# EAGLE design Handdisplay2 (EAGLE 6.6.0)
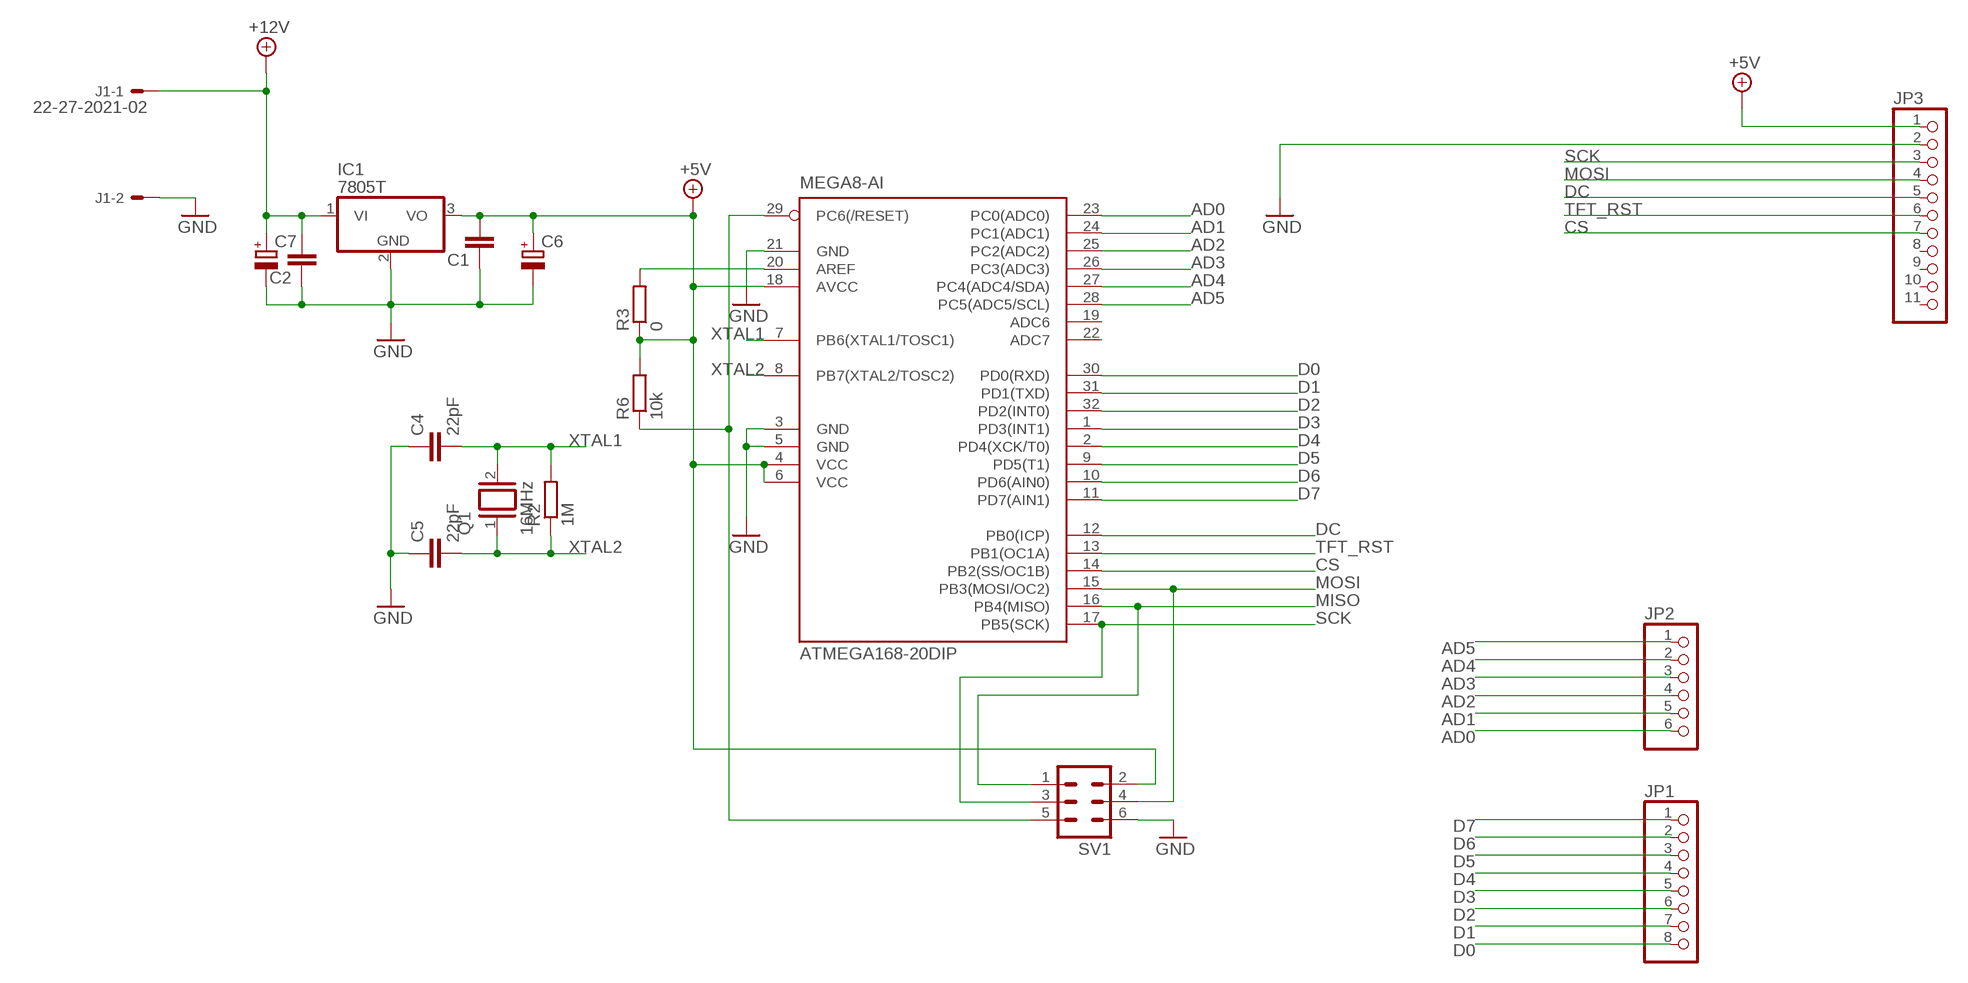
[diagram p0: schematic, sheet 1]

## Parts
ATMEGA168-20DIP  MEGA8-AI  [TQFP32-08]
C1  C-EUC0805  [C0805]
C2  C-EUC0805  [C0805]
C4  22pF  C-EUC0805  [C0805]
C5  22pF  C-EUC0805  [C0805]
C6  CPOL-EUUD-5X5,8  [UD-5X5,8_NICHICON]
C7  CPOL-EUUD-5X5,8  [UD-5X5,8_NICHICON]
IC1  7805T  [TO220H]
J1  22-27-2021-02  [6410-02]
JP1  PINHD-1X8  [1X08]
JP2  PINHD-1X6  [1X06]
JP3  PINHD-1X11  [1X11]
Q1  16MHz  XTAL/S  [QS]
R2  1M  R-EU_R0805  [R0805]
R3  0  R-EU_R0805  [R0805]
R6  10k  R-EU_R0805  [R0805]
SV1  ML6  [ML6]

## Nets
+5V: ATMEGA168-20DIP.4(VCC) ATMEGA168-20DIP.6(VCC) ATMEGA168-20DIP.18(AVCC) C1.2 C6.+ IC1.3(VO) JP3.1 R3.1 R6.2 SV1.2
+12V: C2.2 C7.+ IC1.1(VI) J1.1
AD0: ATMEGA168-20DIP.23(PC0(ADC0)) JP2.6
AD1: ATMEGA168-20DIP.24(PC1(ADC1)) JP2.5
AD2: ATMEGA168-20DIP.25(PC2(ADC2)) JP2.4
AD3: ATMEGA168-20DIP.26(PC3(ADC3)) JP2.3
AD4: ATMEGA168-20DIP.27(PC4(ADC4/SDA)) JP2.2
AD5: ATMEGA168-20DIP.28(PC5(ADC5/SCL)) JP2.1
CS: ATMEGA168-20DIP.14(PB2(SS/OC1B)) JP3.7
D0: ATMEGA168-20DIP.30(PD0(RXD)) JP1.8
D1: ATMEGA168-20DIP.31(PD1(TXD)) JP1.7
D2: ATMEGA168-20DIP.32(PD2(INT0)) JP1.6
D3: ATMEGA168-20DIP.1(PD3(INT1)) JP1.5
D4: ATMEGA168-20DIP.2(PD4(XCK/T0)) JP1.4
D5: ATMEGA168-20DIP.9(PD5(T1)) JP1.3
D6: ATMEGA168-20DIP.10(PD6(AIN0)) JP1.2
D7: ATMEGA168-20DIP.11(PD7(AIN1)) JP1.1
DC: ATMEGA168-20DIP.12(PB0(ICP)) JP3.5
GND: ATMEGA168-20DIP.3(GND) ATMEGA168-20DIP.5(GND) ATMEGA168-20DIP.21(GND) C1.1 C2.1 C4.1 C5.1 C6.- C7.- IC1.2(GND) J1.2 JP3.2 SV1.6
MISO: ATMEGA168-20DIP.16(PB4(MISO)) SV1.1
MOSI: ATMEGA168-20DIP.15(PB3(MOSI/OC2)) JP3.4 SV1.4
N$2: ATMEGA168-20DIP.20(AREF) R3.2
N$15: ATMEGA168-20DIP.29(PC6(/RESET)) R6.1 SV1.5
SCK: ATMEGA168-20DIP.17(PB5(SCK)) JP3.3 SV1.3
TFT_RST: ATMEGA168-20DIP.13(PB1(OC1A)) JP3.6
XTAL1: ATMEGA168-20DIP.7(PB6(XTAL1/TOSC1)) C4.2 Q1.2 R2.2
XTAL2: ATMEGA168-20DIP.8(PB7(XTAL2/TOSC2)) C5.2 Q1.1 R2.1
Unconnected: ATMEGA168-20DIP.19(ADC6) ATMEGA168-20DIP.22(ADC7) JP3.8 JP3.9 JP3.10 JP3.11

## Library data of the parts
ATMEGA168-20DIP = atmel:MEGA8: MICROCONTROLLER 8 Kbytes FLASH, 1 kbytes SRAM, 512 bytes EEPROM, USART, 6-channel 10 bit ADC, 2-channel 8 bit ADC Pin compatible with Atmega48, ATMega88, ATMega168 Source: avr.lbr; MPN: ATMEGA8-16AU; OC_FARNELL: 9171371; OC_NEWARK: 73M8863
C1 C2 C4 C5 = rcl:C-EU: CAPACITOR, European symbol
C6 C7 = rcl:CPOL-EU: POLARIZED CAPACITOR, European symbol
IC1 = linear:78*: Positive VOLTAGE REGULATOR Source: http://cache.national.com/ds/LM/LM78L05.pdf http://www.fairchildsemi.com/ds/LM/LM7805.pdf
J1 = con-molex:22-?-02: CONNECTOR wire to board 2.54 mm (.1 inch) pitch header; OC_FARNELL: unknown; OC_NEWARK: unknown
JP1 = pinhead:PINHD-1X8: PIN HEADER
JP2 = pinhead:PINHD-1X6: PIN HEADER
JP3 = pinhead:PINHD-1X11: PIN HEADER
Q1 = special:XTAL/S: CRYSTAL
R2 R3 R6 = rcl:R-EU_: RESISTOR, European symbol
SV1 = con-ml:ML6: HARTING; OC_FARNELL: unknown; OC_NEWARK: unknown

## Net classes
0 default: clearance 0.254 mm

## Board
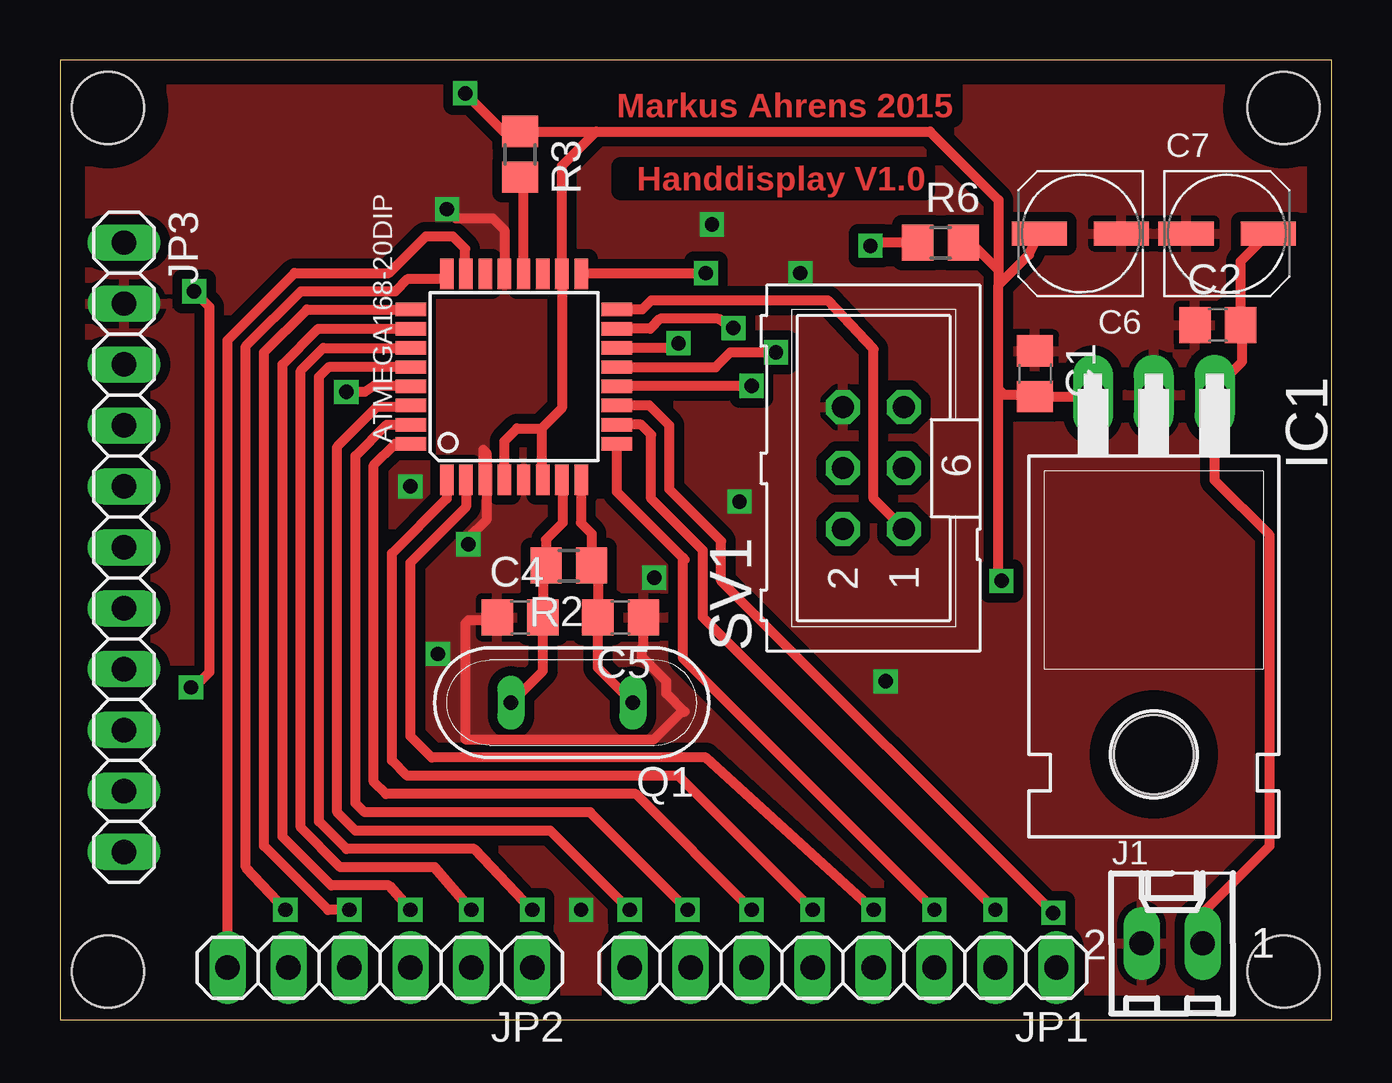
[diagram p1: board, top side]
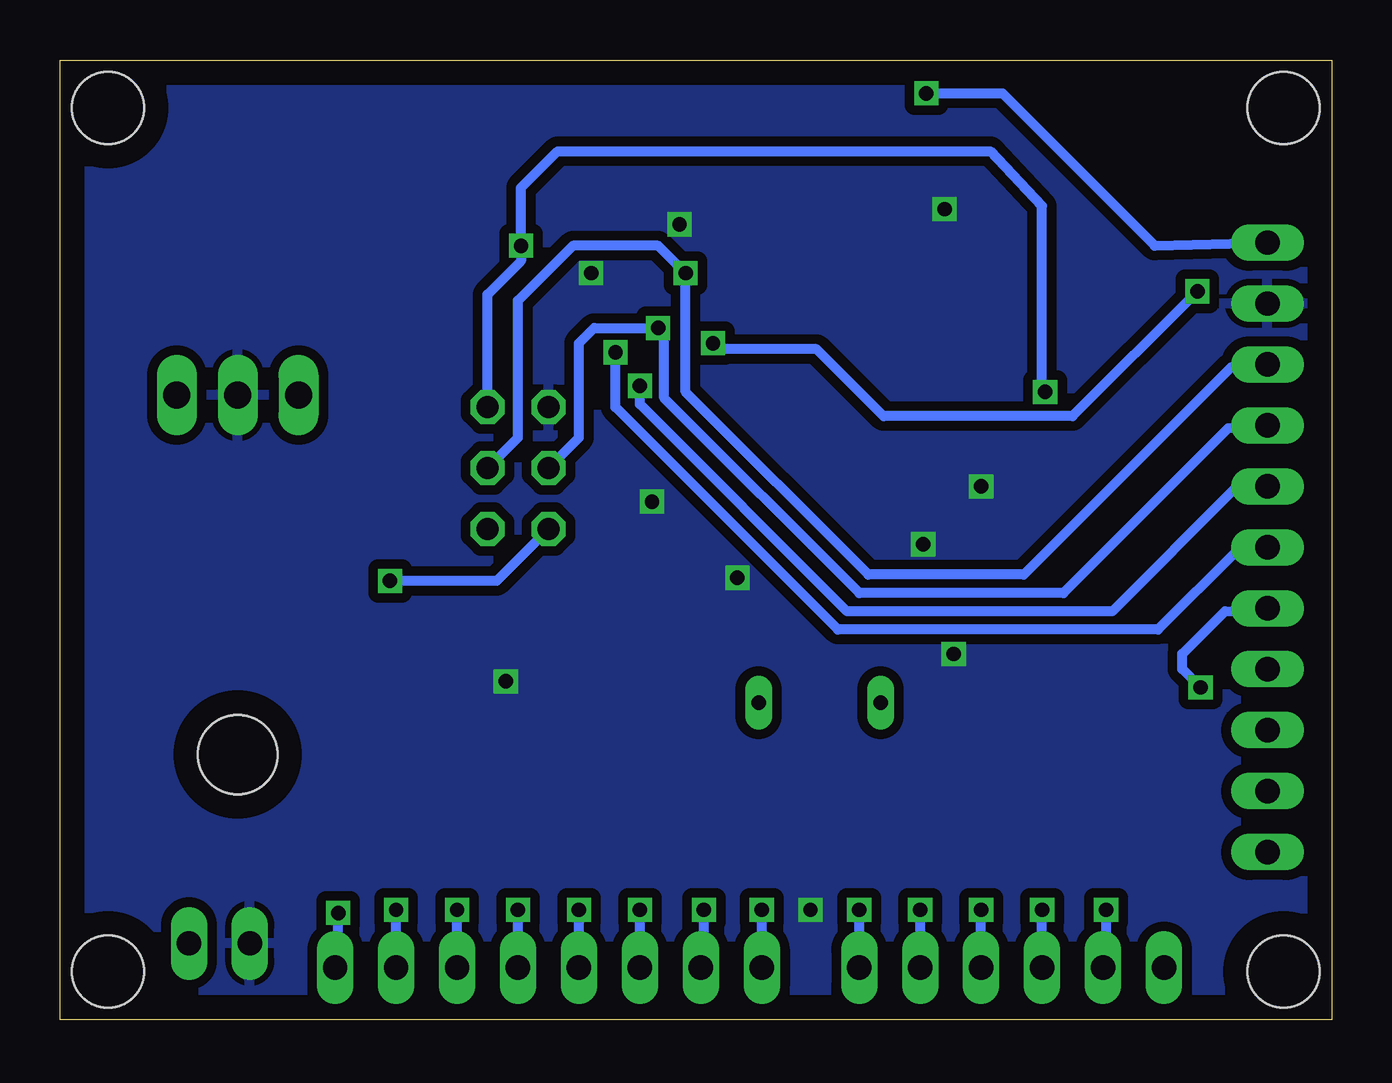
[diagram p2: board, bottom side, seen from below]

Size 53 x 40 mm. Coordinates in mm from the lower left corner, seen from the top.
Outline: 0,0 53,0 53,40 0,40 0,0
Copper layers (1*16): Top 0.035mm / dielectric 1.5mm / Bottom 0.035mm
Design rules "default *": minimum track width 10mil, minimum drill 24mil, track to track 16mil, track to pad 8mil, pad to pad 8mil, via to via 8mil, smd to smd 8mil, copper to edge 40mil, drill to drill 8mil, minimum pad ring 10mil, minimum via ring 8mil, stop-mask expansion 4mil, vias tented up to drill 0mil, thermal gap 10mil
Holes 3 mm at 2,38 51,38 51,2 2,2

### Footprints (pad centres in the part's own frame; a part is rotated, then mirrored left to right if it is on the bottom)
TQFP32-08 = smd 1.27 x 0.559: 1 -4.293,2.8; 2 -4.293,2; 3 -4.293,1.2; 4 -4.293,0.4; 5 -4.293,-0.4; 6 -4.293,-1.2; 7 -4.293,-2; 8 -4.293,-2.8; 17 4.293,-2.8; 18 4.293,-2; 19 4.293,-1.2; 20 4.293,-0.4; 21 4.293,0.4; 22 4.293,1.2; 23 4.293,2; 24 4.293,2.8 | smd 0.559 x 1.27: 9 -2.8,-4.293; 10 -2,-4.293; 11 -1.2,-4.293; 12 -0.4,-4.293; 13 0.4,-4.293; 14 1.2,-4.293; 15 2,-4.293; 16 2.8,-4.293; 25 2.8,4.293; 26 2,4.293; 27 1.2,4.293; 28 0.4,4.293; 29 -0.4,4.293; 30 -1.2,4.293; 31 -2,4.293; 32 -2.8,4.293
C0805 = smd 1.3 x 1.5: 1 -0.95,0; 2 0.95,0
UD-5X5,8_NICHICON = smd 2.3 x 1: + 1.725,0; - -1.7,0
TO220H = drill 1.118 long: 1 -2.54,-10.16; 2 0,-10.16; 3 2.54,-10.16 | hole 3.302: 0,4.826
6410-02 = drill 1.016 long: 1 1.27,0; 2 -1.27,0
1X08 = drill 1.016 long: 1 -8.89,0; 2 -6.35,0; 3 -3.81,0; 4 -1.27,0; 5 1.27,0; 6 3.81,0; 7 6.35,0; 8 8.89,0
1X06 = drill 1.016 long: 1 -6.35,0; 2 -3.81,0; 3 -1.27,0; 4 1.27,0; 5 3.81,0; 6 6.35,0
1X11 = drill 1.016 long: 1 -12.7,0; 2 -10.16,0; 3 -7.62,0; 4 -5.08,0; 5 -2.54,0; 6 0,0; 7 2.54,0; 8 5.08,0; 9 7.62,0; 10 10.16,0; 11 12.7,0
QS = drill 0.61 long: 1 -2.54,0; 2 2.54,0
R0805 = smd 1.3 x 1.5: 1 -0.95,0; 2 0.95,0
ML6 = drill 0.914 octagon: 1 -2.54,-1.27; 2 -2.54,1.27; 3 0,-1.27; 4 0,1.27; 5 2.54,-1.27; 6 2.54,1.27

### Placement (x,y rotation side)
ATMEGA168-20DIP  18.92,26.8 90 top
C1  40.64,26.92 270 top
C2  48.26,28.96 0 top
C4  19.18,16.76 0 top
C5  23.37,16.76 180 top
C6  42.55,32.77 180 top
C7  48.64,32.77 0 top
IC1  45.59,15.88 180 top
J1  46.35,3.17 0 top
JP1  32.64,2.16 180 top
JP2  13.34,2.16 180 top
JP3  2.67,19.68 270 top
Q1  21.34,13.21 180 top
R2  21.21,18.92 180 top
R3  19.18,36.07 270 top
R6  36.7,32.38 0 top
SV1  33.91,22.99 90 top

### Tracks (layer width: path | path; a pad name or v marks a point on that pad's centre or on a via)
+5V  (via drill 0.6)
  Top 0.406: IC1.3 arc-90 42.99,25.97 C1.2 40.58,26.04 39.37,26.04 39.12,26.29 | 39.12,26.29 39.12,30.61 | 39.12,30.61 40.39,31.88 C6.+ | 22.35,37.02 R3.1 18.48,37.02 v16.89,38.61 | 22.35,37.02 36.26,37.02 39.12,34.16 39.12,31.24 | 39.12,31.24 39.12,30.61 | 22.35,37.02 20.92,35.59 ATMEGA168-20DIP.18 20.92,25.5 20.07,24.64 | R6.2 37.97,32.38 39.12,31.24 | v39.24,18.29 39.12,18.41 39.12,26.29 | 20.07,24.64 20.07,22.56 ATMEGA168-20DIP.6 | ATMEGA168-20DIP.4 18.52,24.11 19.05,24.64 20.07,24.64
  Bottom 0.406: SV1.2 34.8,18.29 v39.24,18.29 | v16.89,38.61 13.72,38.61 7.37,32.26 JP3.1
+12V
  Top 0.406: J1.1 47.62,4.45 50.42,7.24 50.42,20.19 48.13,22.48 IC1.1 48.13,26.29 49.28,27.43 49.28,28.89 C2.2 49.21,31.61 C7.+
AD0
  Top 0.406: JP2.6 6.99,28.32 9.78,31.11 13.72,31.11 15.24,32.64 16.38,32.64 16.89,32.13 16.89,31.12 ATMEGA168-20DIP.23
AD1  (via drill 0.6)
  Top 0.406: ATMEGA168-20DIP.24 15.89,30.86 14.48,30.86 13.97,30.35 10.03,30.35 7.75,28.07 7.75,6.35 v9.4,4.57
  Bottom 0.406: v9.4,4.57 9.4,2.29 JP2.5
AD2  (via drill 0.6)
  Top 0.406: v12.06,4.57 11.18,4.57 8.51,7.24 8.51,27.81 10.29,29.6 ATMEGA168-20DIP.25
  Bottom 0.406: JP2.4 v12.06,4.57
AD3  (via drill 0.6)
  Top 0.406: v14.61,4.57 13.72,5.59 11.3,5.59 9.27,7.62 9.27,27.3 10.76,28.8 ATMEGA168-20DIP.26
  Bottom 0.406: JP2.3 v14.61,4.57
AD4  (via drill 0.6)
  Top 0.406: v17.14,4.57 15.62,6.35 11.68,6.35 10.03,8 10.03,27.05 10.98,28 ATMEGA168-20DIP.27
  Bottom 0.406: JP2.2 v17.14,4.57
AD5  (via drill 0.6)
  Top 0.406: v19.68,4.57 17.27,7.11 11.94,7.11 10.79,8.26 10.79,26.8 11.2,27.2 ATMEGA168-20DIP.28
  Bottom 0.406: JP2.1 v19.68,4.57
CS  (via drill 0.6)
  Top 0.406: v25.78,28.19 arc90 25.85,28 ATMEGA168-20DIP.14 | v5.59,30.35 6.22,29.72 6.22,14.48 5.59,13.84 v5.46,13.84
  Bottom 0.406: v25.78,28.19 25.65,27.94 21.46,27.94 18.67,25.15 10.79,25.15 v5.59,30.35 | v5.46,13.84 6.22,14.61 6.22,15.24 4.45,17.02 JP3.7
D0  (via drill 0.6)
  Top 0.406: v23.75,4.57 20.45,7.87 12.32,7.87 11.56,8.64 11.56,23.88 13.21,25.53 14.56,25.53 ATMEGA168-20DIP.30
  Bottom 0.406: JP1.8 v23.75,4.57
D1  (via drill 0.6)
  Top 0.406: v26.16,4.57 22.1,8.64 12.7,8.64 12.32,9.02 12.32,23.5 13.62,24.8 ATMEGA168-20DIP.31
  Bottom 0.406: v26.16,4.57 26.16,2.29 JP1.7
D2  (via drill 0.6)
  Top 0.406: v28.83,4.57 24,9.4 13.59,9.4 13.08,9.91 13.08,23.11 13.96,24 ATMEGA168-20DIP.32
  Bottom 0.406: JP1.6 v28.83,4.57
D3  (via drill 0.6)
  Top 0.406: v31.37,4.57 25.78,10.16 14.48,10.16 13.84,10.79 13.84,19.43 16.12,21.71 ATMEGA168-20DIP.1
  Bottom 0.406: JP1.5 v31.37,4.57
D4  (via drill 0.6)
  Top 0.406: v33.91,4.57 26.92,10.92 15.49,10.92 14.61,11.81 14.61,19.05 16.92,21.37 ATMEGA168-20DIP.2
  Bottom 0.406: JP1.4 v33.91,4.57
D5  (via drill 0.6)
  Top 0.406: 26.04,19.18 25.97,19.24 | 25.97,19.24 23.22,22 ATMEGA168-20DIP.9 | v36.45,4.57 25.97,15.05 25.97,19.24
  Bottom 0.406: JP1.3 v36.45,4.57
D6  (via drill 0.6)
  Top 0.406: ATMEGA168-20DIP.10 24.23,24.8 24.64,24.38 24.64,21.72 26.8,19.56 26.8,16.76 v38.99,4.57
  Bottom 0.406: JP1.2 v38.99,4.57
D7  (via drill 0.6)
  Top 0.406: ATMEGA168-20DIP.11 24.57,25.6 25.4,24.77 25.4,22.1 27.56,19.94 27.56,18.29 v41.4,4.45
  Bottom 0.406: JP1.1 41.4,2.29 v41.4,4.45
DC  (via drill 0.6)
  Top 0.406: v28.83,26.42 28.81,26.4 ATMEGA168-20DIP.12
  Bottom 0.406: v28.83,26.42 28.83,25.65 20.19,17.02 9.14,17.02 4.06,22.1 JP3.5
GND  (via drill 0.6)
  Top 0.406: v16.13,33.78 16.51,33.4 18.03,33.4 18.52,32.91 ATMEGA168-20DIP.21 | ATMEGA168-20DIP.3 17.65,22.57 17.65,23.75 17.78,23.62 17.78,20.83 17.02,20.07 v17.02,19.81 | C4.1 18.1,16.64 17.02,16.64 16.89,16.51 16.89,11.68 24.77,11.68 25.91,12.83 26.04,12.83 25.27,13.59 25.27,14.1 24.26,15.11 24.26,15.49 24.32,15.55 C5.1
  other vias: 27.18,33.15 14.61,22.23 15.75,15.24 28.32,21.59 34.42,14.1 30.86,31.11 21.72,4.57 24.77,18.41
  pour Top: 0.13,-0.13 53.09,-0.13 53.09,40.51 0.13,40.51
  pour Bottom: 0.13,-0.13 53.09,-0.13 53.09,40.64 0.13,40.64
MISO
  Top 0.406: SV1.1 33.91,21.72 33.91,27.94 32,29.97 24.64,29.97 24.26,29.6 ATMEGA168-20DIP.16
MOSI  (via drill 0.6)
  Top 0.406: v28.07,28.83 27.43,29.21 25.02,29.21 24.61,28.8 ATMEGA168-20DIP.15
  Bottom 0.406: SV1.4 31.37,24.26 31.37,28.19 30.73,28.83 v28.07,28.83 27.81,28.83 27.81,25.91 19.68,17.78 11.18,17.78 4.32,24.64 JP3.4
N$2
  Top 0.406: ATMEGA168-20DIP.20 19.32,35.12 R3.2
N$15  (via drill 0.6)
  Top 0.406: ATMEGA168-20DIP.29 14.61,26.42 13.08,26.42 12.7,26.16 v11.94,26.16 | R6.1 33.91,32.38 v33.78,32.26
  Bottom 0.406: SV1.5 35.18,30.23 33.78,31.62 v33.78,32.26 33.78,34.67 32.26,36.2 14.22,36.2 12.06,33.91 12.06,26.16 v11.94,26.16
SCK  (via drill 0.6)
  Top 0.406: v26.92,31.11 26.7,31.09 ATMEGA168-20DIP.17
  Bottom 0.406: SV1.3 33.91,24.26 33.91,29.97 31.62,32.26 28.07,32.26 v26.92,31.11 26.92,26.16 19.3,18.54 12.83,18.54 4.19,27.18 JP3.3
TFT_RST  (via drill 0.6)
  Top 0.406: ATMEGA168-20DIP.13 27.32,27.2 27.94,27.81 v29.84,27.81
  Bottom 0.406: v29.84,27.81 29.84,25.53 20.57,16.26 7.24,16.26 3.94,19.56 JP3.6
XTAL1
  Top 0.406: ATMEGA168-20DIP.7 20.95,22.47 20.95,20.7 20.26,20 R2.2 20.13,18.79 C4.2 20.13,14.54 Q1.2
XTAL2
  Top 0.406: ATMEGA168-20DIP.8 21.72,20.7 22.16,20.26 R2.1 22.42,18.66 C5.2 22.42,14.67 Q1.1

### Text on the board
Top: Markus Ahrens 2015 | Handdisplay V1.0